# EAGLE design draft (EAGLE 9.6.2)
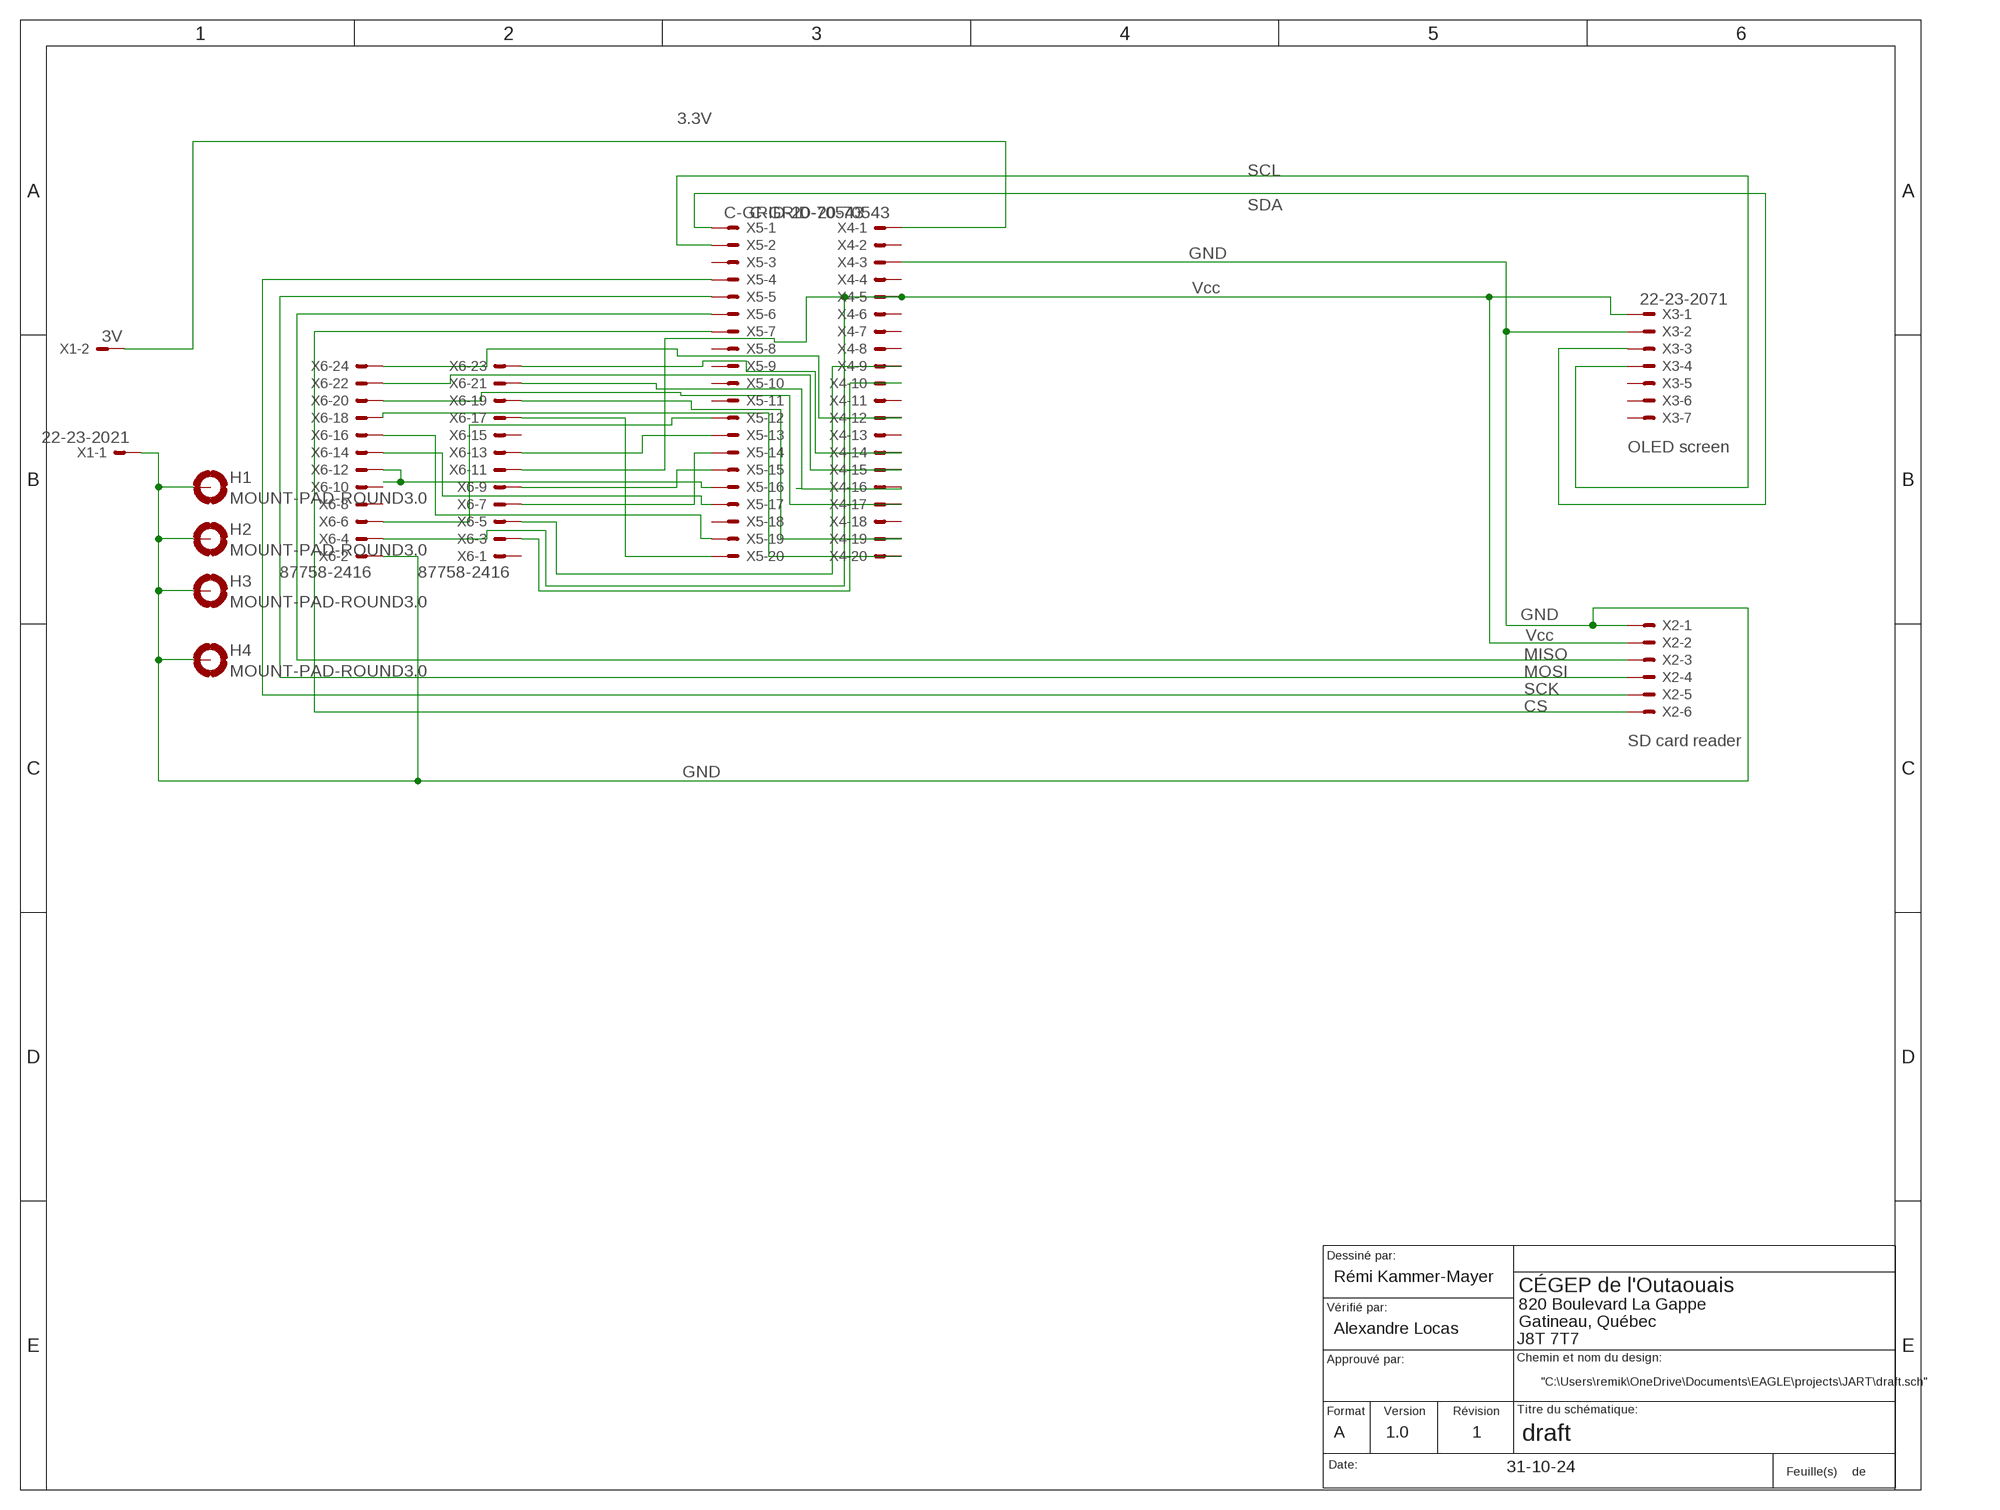
[diagram p0: schematic, sheet 1]

## Parts
H1  MOUNT-PAD-ROUND3.0  [3,0-PAD]
H2  MOUNT-PAD-ROUND3.0  [3,0-PAD]
H3  MOUNT-PAD-ROUND3.0  [3,0-PAD]
H4  MOUNT-PAD-ROUND3.0  [3,0-PAD]
X1  22-23-2021  [22-23-2021]
X2  22-23-2061  [22-23-2061]
X3  22-23-2071  [22-23-2071]
X4  C-GRID-20-70543  [70543-20]
X5  C-GRID-20-70543  [70543-20]
X6  87758-2416  [87758-2416]

## Nets
GND: H1.B3,0(MOUNT) H2.B3,0(MOUNT) H3.B3,0(MOUNT) H4.B3,0(MOUNT) X1.1 X2.1 X3.2 X4.3 X6.2
N$2: X5.17 X6.14
N$3: X2.2 X3.1 X4.5 X6.4 X6.11
N$4: X3.4 X5.2
N$5: X4.10 X6.3
N$6: X2.5 X5.4
N$7: X2.4 X5.5
N$8: X2.3 X5.6
N$9: X2.6 X5.7
N$10: X4.9 X6.5
N$11: X1.2 X4.1
N$12: X3.3 X5.1
N$13: X5.12 X6.6
N$14: X5.14 X6.7
N$15: X5.15 X6.9
N$16: X5.16 X6.12
N$17: X4.20 X6.18
N$18: X5.19 X6.16
N$19: X5.13 X6.13
N$20: X5.20 X6.17
N$21: X4.19 X6.19
N$22: X4.17 X6.20
N$23: X4.16 X6.21
N$24: X4.15 X6.22
N$25: X4.14 X6.23
N$26: X4.12 X6.24
Unconnected: X3.5 X3.6 X3.7 X4.2 X4.4 X4.6 X4.7 X4.8 X4.11 X4.13 X4.18 X5.3 X5.8 X5.9 X5.10 X5.11 X5.18 X6.1 X6.8 X6.10 X6.15

## Notes on the sheet
- 3.3V
- SCL
- SDA
- GND
- Vcc
- 3V
- OLED screen
- GND
- Vcc
- MISO
- MOSI
- SCK
- CS
- SD card reader
- GND
- Rémi Kammer-Mayer
- Alexandre Locas
- "C:\Users\remik\OneDrive\Documents\EAGLE\projects\JART\draft.sch"
- A | 1.0 | 1
- 31-10-24

## Library data of the parts
H1-H4 = holes:MOUNT-PAD-ROUND: MOUNTING PAD, round
X1 = con-molex:22-23-2021: .100" (2.54mm) Center Header - 2 Pin; MF: MOLEX; MPN: 22-23-2021; OC_FARNELL: 1462926; OC_NEWARK: 25C3832
X2 = con-molex:22-23-2061: .100" (2.54mm) Center Header - 6 Pin; MF: MOLEX; MPN: 22-23-2061; OC_FARNELL: 1462922; OC_NEWARK: 27C1933
X3 = con-molex:22-23-2071: .100" (2.54mm) Center Header - 7 Pin; MF: MOLEX; MPN: 22-23-2071; OC_FARNELL: 1654534; OC_NEWARK: 56H0445
X4 X5 = con-molex:C-GRID-20: CONNECTOR wire to board 2.54 mm (0.100") pitch header; MF: MOLEX; OC_FARNELL: unknown; OC_NEWARK: unknown
X6 = con-molex:87758-2416: 24 Pin - 2mm Dual Row Single Wafer, Vertical T/H HDR Source: http://www.molex.com/pdm_docs/sd/877580616_sd.pdf; MF: MOLEX; MPN: 87758-2416; OC_FARNELL: unknown; OC_NEWARK: 25M5679

## Board
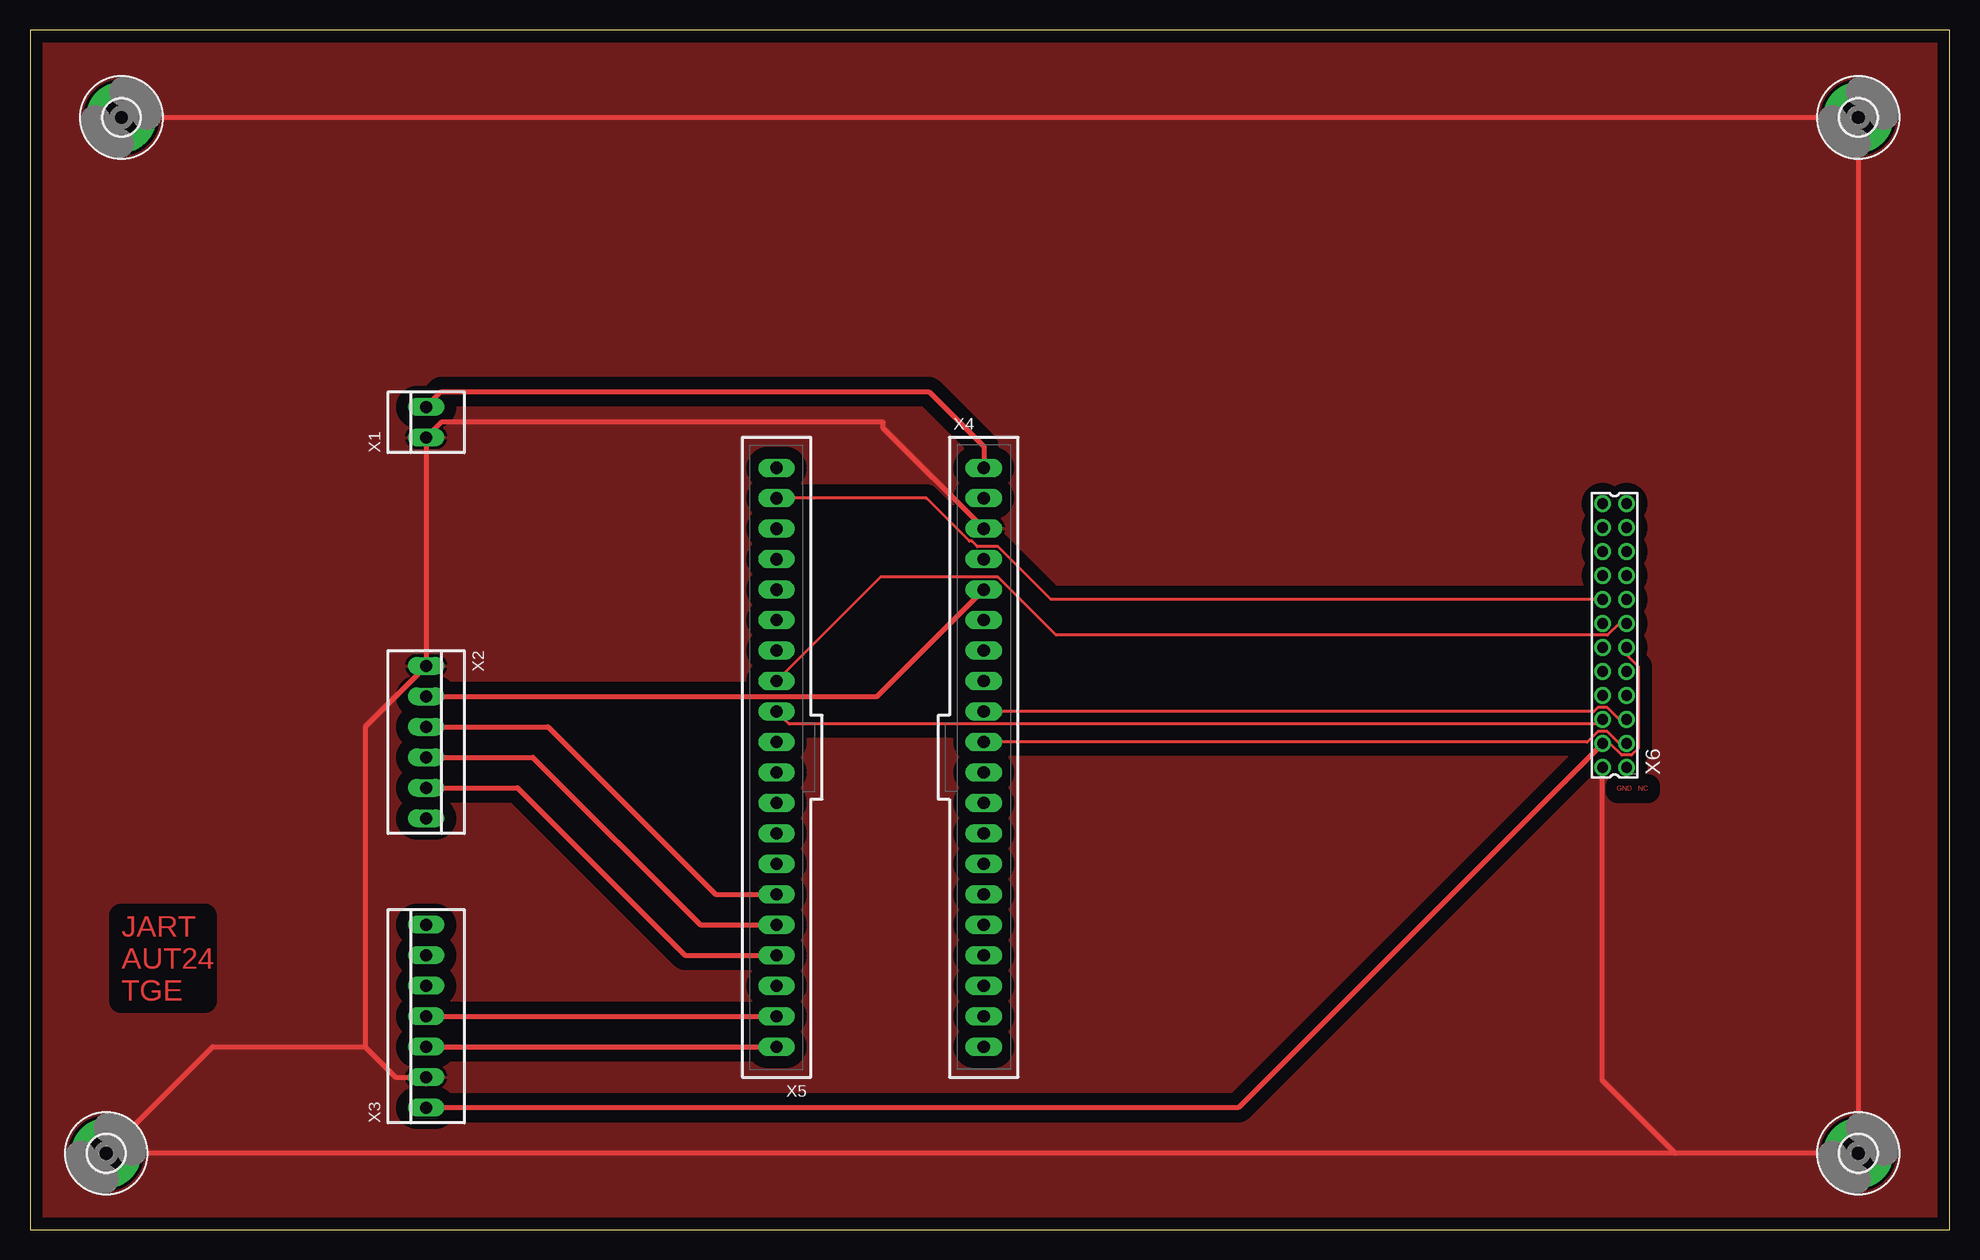
[diagram p1: board, top side]
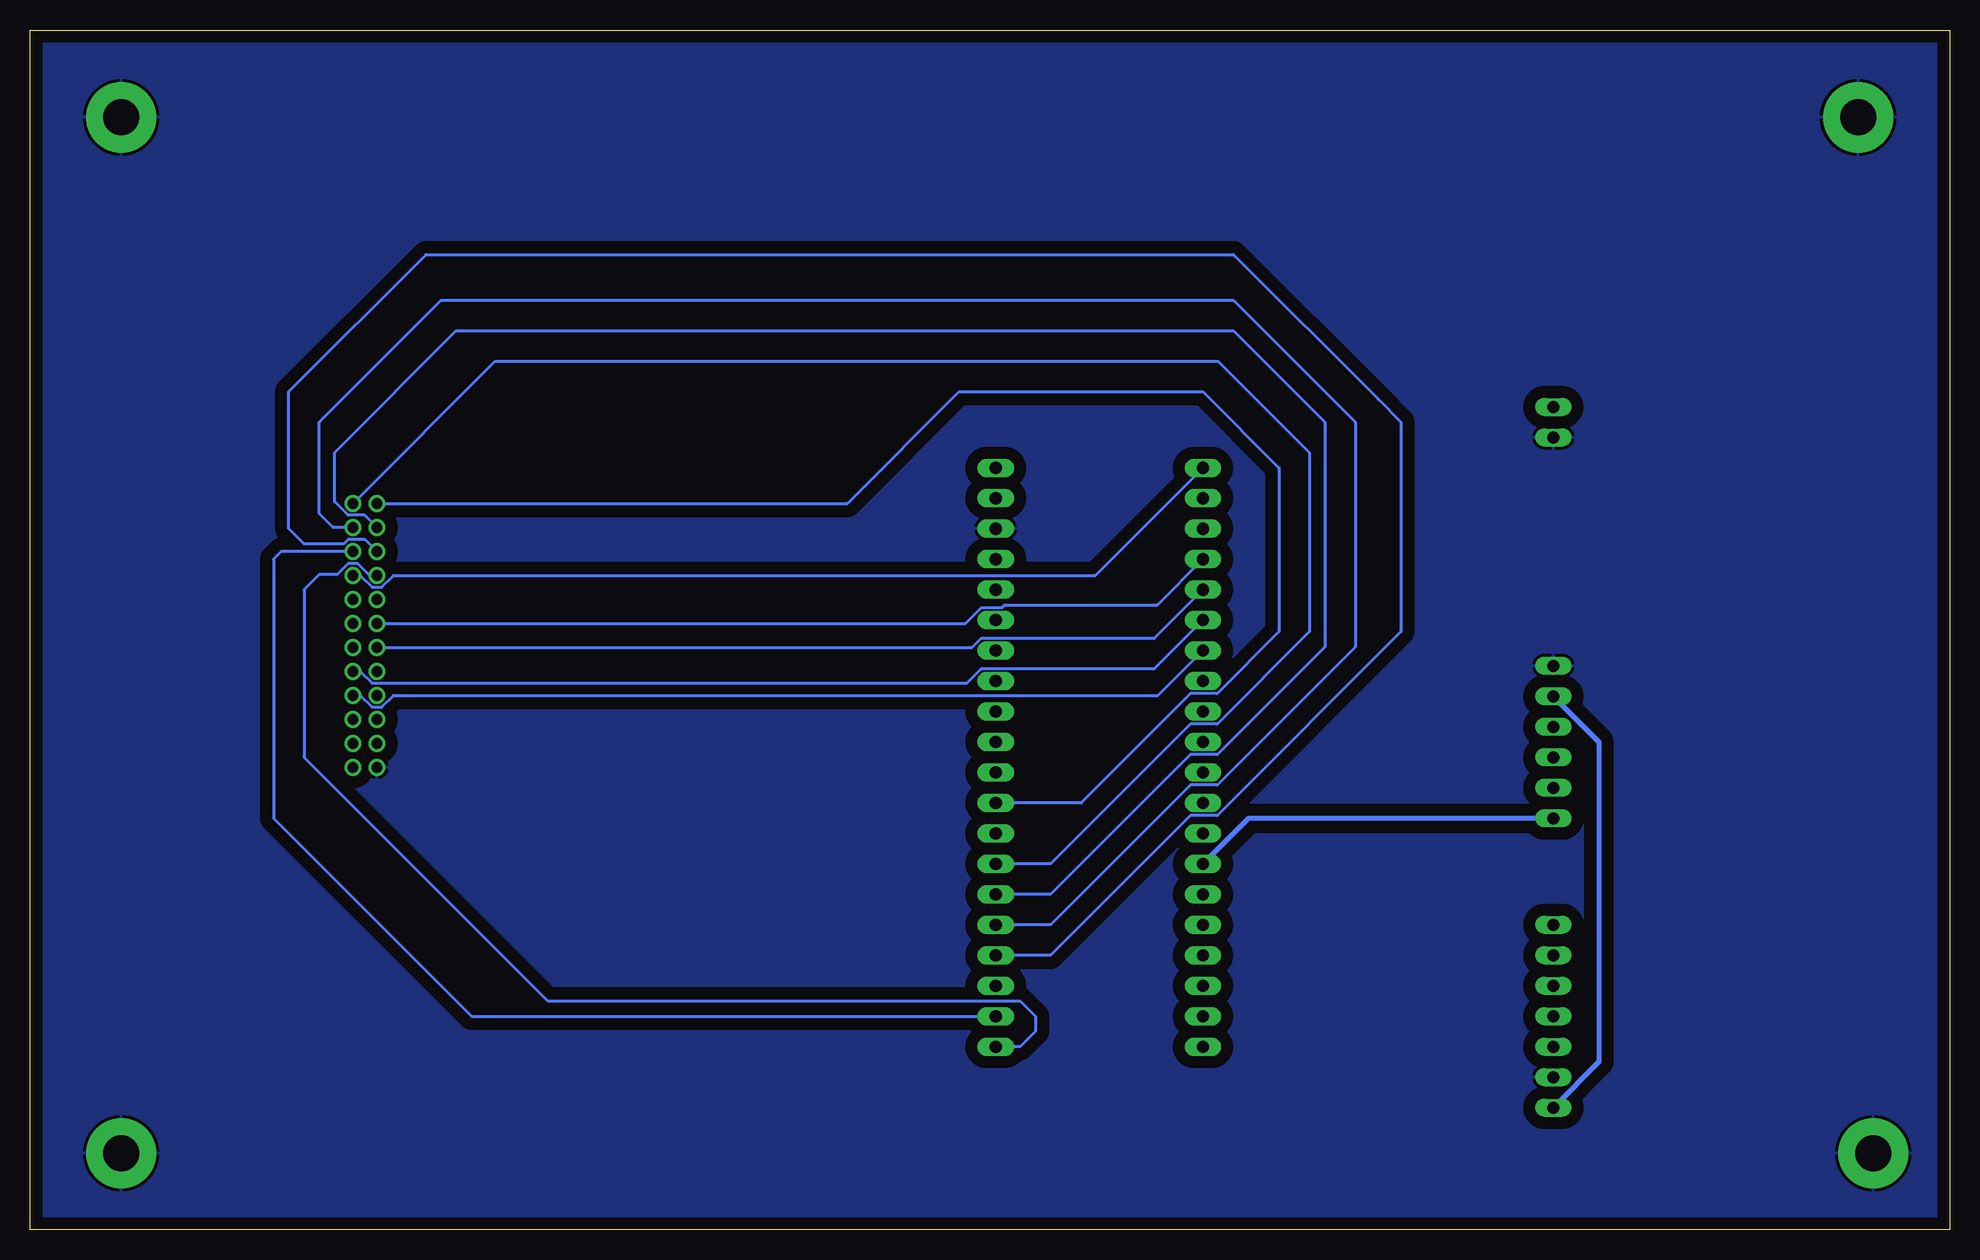
[diagram p2: board, bottom side, seen from below]

Size 160 x 100 mm. Coordinates in mm from the lower left corner, seen from the top.
Outline: 0,0 160,0 160,100 0,100 0,0
Copper layers (1*16): Top 0.035mm / dielectric 1.5mm / Bottom 0.035mm
Design rules "default": minimum track width 6mil, minimum drill 0.35mm, track to track 6mil, track to pad 6mil, pad to pad 6mil, via to via 6mil, smd to smd 6mil, copper to edge 40mil, drill to drill 6mil, minimum pad ring 10mil, minimum via ring 8mil, stop-mask expansion 4mil, vias tented up to drill 0mil, thermal gap 10mil

### Footprints (pad centres in the part's own frame; a part is rotated, then mirrored left to right if it is on the bottom)
3,0-PAD = drill 3 pad 5.842: B3,0 0,0
22-23-2021 = drill 1 long: 1 -1.27,0; 2 1.27,0
22-23-2061 = drill 1 long: 1 -6.35,0; 2 -3.81,0; 3 -1.27,0; 4 1.27,0; 5 3.81,0; 6 6.35,0
22-23-2071 = drill 1 long: 1 -7.62,0; 2 -5.08,0; 3 -2.54,0; 4 0,0; 5 2.54,0; 6 5.08,0; 7 7.62,0
70543-20 = drill 1.016 long: 1 -24.13,0; 2 -21.59,0; 3 -19.05,0; 4 -16.51,0; 5 -13.97,0; 6 -11.43,0; 7 -8.89,0; 8 -6.35,0; 9 -3.81,0; 10 -1.27,0; 11 1.27,0; 12 3.81,0; 13 6.35,0; 14 8.89,0; 15 11.43,0; 16 13.97,0; 17 16.51,0; 18 19.05,0; 19 21.59,0; 20 24.13,0
87758-2416 = drill 0.9 pad 1.27: 1 -11,-1; 2 -11,1; 3 -9,-1; 4 -9,1; 5 -7,-1; 6 -7,1; 7 -5,-1; 8 -5,1; 9 -3,-1; 10 -3,1; 11 -1,-1; 12 -1,1; 13 1,-1; 14 1,1; 15 3,-1; 16 3,1; 17 5,-1; 18 5,1; 19 7,-1; 20 7,1; 21 9,-1; 22 9,1; 23 11,-1; 24 11,1

### Placement (x,y rotation side)
H1  6.35,6.35 0 top
H2  152.4,6.35 0 top
H3  152.4,92.71 0 top
H4  7.62,92.71 0 top
X1  33.02,67.31 90 top
X2  33.02,40.64 270 top
X3  33.02,17.78 90 top
X4  79.5,39.37 270 top
X5  62.23,39.37 90 top
X6  132.08,49.53 90 top

### Tracks (layer width: path | path; a pad name or v marks a point on that pad's centre or on a via)
GND
  Top 0.406: X4.3 71.12,66.8 71.12,67.31 34.29,67.31 X1.1 X2.1 27.94,41.91 27.94,15.24 | 27.94,15.24 30.48,12.7 X3.2 | H4.B3,0 H3.B3,0 H2.B3,0 | H2.B3,0 H1.B3,0 15.24,15.24 27.94,15.24 | H2.B3,0 137.16,6.35 131.08,12.43 X6.2
  pour Top (isolate 1.016): 0,100.33 0,0 160.02,0 160.02,100.33
  pour Bottom (isolate 1.016): 0,100.33 0,0 160.02,0 160.02,100.33
N$2
  Bottom 0.254: X6.14 82.01,50.53 80.69,51.84 78.97,51.84 78.74,52.07 66.04,52.07 X5.17
N$3
  Top 0.254: X6.11 133.08,47.92 134.06,46.94 134.06,40.12 133.49,39.55 132.67,39.55 131.77,40.45 131,40.45
  Top 0.406: X2.2 70.61,44.45 X4.5 | X6.4 131,40.45 100.71,10.16 X3.1
  Bottom 0.406: X2.2 29.21,40.64 29.21,13.97 X3.1
N$4
  Top 0.406: X3.4 X5.2
N$5
  Top 0.254: X6.3 132.47,40.53 131.49,41.51 130.67,41.51 129.8,40.64 X4.10
N$6
  Top 0.406: X2.5 40.64,36.83 54.61,22.86 X5.4
N$7
  Top 0.406: X2.4 41.91,39.37 55.88,25.4 X5.5
N$8
  Top 0.406: X2.3 43.18,41.91 57.15,27.94 X5.6
N$9
  Bottom 0.406: X2.6 58.42,34.29 X5.7
N$10
  Top 0.254: X6.5 132.47,42.53 131.49,43.51 130.67,43.51 130.34,43.18 X4.9
N$11
  Top 0.406: X1.2 34.29,69.85 74.93,69.85 79.5,65.28 X4.1
N$12
  Top 0.406: X3.3 X5.1
N$13
  Top 0.254: X6.6 130.69,42.14 63.27,42.14 X5.12
N$14
  Bottom 0.254: X5.14 65.96,44.53 129.69,44.53 130.67,43.55 131.49,43.55 132.47,44.53 X6.7
N$15
  Bottom 0.254: X6.9 132.47,46.53 131.49,45.55 81.91,45.55 80.69,46.76 66.27,46.76 X5.15
N$16
  Bottom 0.254: X6.12 81.47,48.53 80.69,49.3 66.27,49.3 X5.16
N$17
  Bottom 0.254: X6.18 131.69,54.53 132.67,55.51 133.49,55.51 134.39,54.61 135.89,54.61 137.16,53.34 137.16,39.37 116.84,19.05 77.47,19.05 76.2,17.78 76.2,16.51 77.47,15.24 X4.20
N$18
  Top 0.254: X6.16 85.09,52.53 80.69,56.92 78.97,56.92 78.51,57.38 78.31,57.38 74.73,60.96 X5.19
N$19
  Top 0.254: X6.13 132.47,50.53 131.49,49.55 85.53,49.55 80.69,54.38 70.89,54.38 X5.13
N$20
  Bottom 0.254: X5.20 71.2,54.53 129.69,54.53 130.67,53.55 131.49,53.55 132.47,54.53 X6.17
N$21
  Bottom 0.254: X6.19 139.05,56.53 139.7,55.88 139.7,34.29 123.19,17.78 X4.19
N$22
  Bottom 0.254: X6.20 132.06,57.51 133.49,57.51 133.85,57.15 137.16,57.15 138.43,58.42 138.43,69.85 127,81.28 59.69,81.28 47.62,69.22 45.72,67.31 45.72,49.84 61.04,34.52 63.27,34.52 74.93,22.86 X4.17 80.01,22.86
N$23
  Bottom 0.254: X6.21 134.73,58.53 135.89,59.69 135.89,67.31 125.73,77.47 59.69,77.47 49.53,67.31 49.53,48.56 61.04,37.06 63.27,37.06 74.93,25.4 X4.16
N$24
  Bottom 0.254: X6.22 132.1,59.55 133.49,59.55 134.62,60.68 134.62,64.77 124.46,74.93 59.69,74.93 52.07,67.31 52.07,48.56 61.04,39.6 63.27,39.6 74.93,27.94 X4.15
N$25
  Bottom 0.254: X6.23 121.22,72.39 60.96,72.39 53.34,64.77 53.34,49.84 61.04,42.14 63.27,42.14 74.93,30.48 X4.14
N$26
  Bottom 0.254: X6.24 91.87,60.53 82.55,69.85 62.23,69.85 55.88,63.5 55.88,49.84 61.04,44.68 63.27,44.68 72.39,35.56 X4.12

### Text on the board
Top: GND NC | JART / AUT24 / TGE